# EAGLE design segundero (EAGLE 7.2.0)
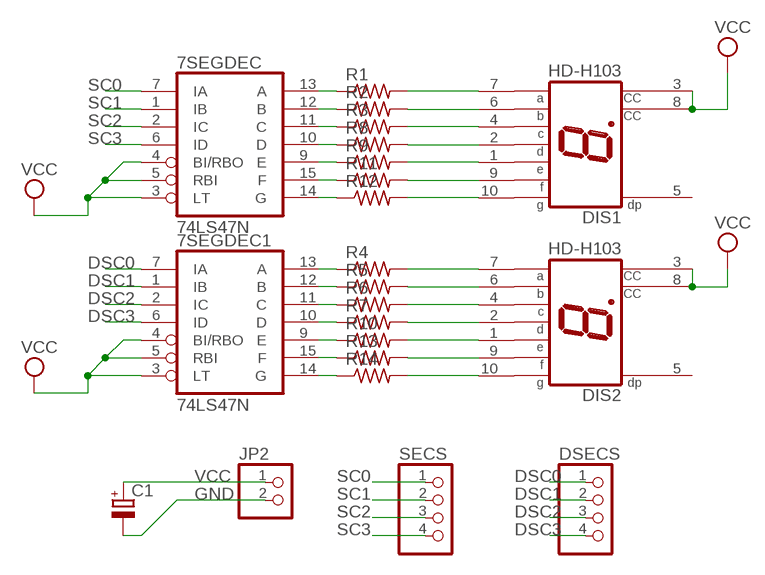
[diagram p0: schematic, sheet 1]

## Parts
7SEGDEC  74LS47N  [DIL16]
7SEGDEC1  74LS47N  [DIL16]
C1  CPOL-EUE2-5  [E2-5]
DIS1  HD-H103  [HDSP-M]
DIS2  HD-H103  [HDSP-M]
DSECS  PINHD-1X4  [1X04]
JP2  PINHD-1X2  [1X02]
R1  R-US_0204/7  [0204/7]
R2  R-US_0204/7  [0204/7]
R3  R-US_0204/7  [0204/7]
R4  R-US_0204/7  [0204/7]
R5  R-US_0204/7  [0204/7]
R6  R-US_0204/7  [0204/7]
R7  R-US_0204/7  [0204/7]
R8  R-US_0204/7  [0204/7]
R9  R-US_0204/7  [0204/7]
R10  R-US_0204/7  [0204/7]
R11  R-US_0204/7  [0204/7]
R12  R-US_0204/7  [0204/7]
R13  R-US_0204/7  [0204/7]
R14  R-US_0204/7  [0204/7]
SECS  PINHD-1X4  [1X04]

## Nets
DSC0: 7SEGDEC1.7(IA) DSECS.1
DSC1: 7SEGDEC1.1(IB) DSECS.2
DSC2: 7SEGDEC1.2(IC) DSECS.3
DSC3: 7SEGDEC1.6(ID) DSECS.4
GND: C1.- JP2.2
N$1: 7SEGDEC1.15(F) R13.1
N$2: 7SEGDEC1.13(A) R4.1
N$3: 7SEGDEC.15(F) R11.1
N$4: 7SEGDEC1.12(B) R5.1
N$5: 7SEGDEC.13(A) R1.1
N$6: 7SEGDEC1.11(C) R6.1
N$7: 7SEGDEC1.10(D) R7.1
N$8: 7SEGDEC1.9(E) R10.1
N$9: 7SEGDEC.12(B) R2.1
N$10: 7SEGDEC.11(C) R3.1
N$11: 7SEGDEC.10(D) R8.1
N$12: 7SEGDEC.9(E) R9.1
N$13: 7SEGDEC.14(G) R12.1
N$14: 7SEGDEC1.14(G) R14.1
N$15: DIS1.7(A) R1.2
N$16: DIS1.6(B) R2.2
N$17: DIS1.4(C) R3.2
N$18: DIS1.2(D) R8.2
N$19: DIS1.1(E) R9.2
N$20: DIS1.9(F) R11.2
N$21: DIS1.10(G) R12.2
N$22: DIS2.7(A) R4.2
N$23: DIS2.6(B) R5.2
N$24: DIS2.4(C) R6.2
N$25: DIS2.2(D) R7.2
N$26: DIS2.1(E) R10.2
N$27: DIS2.9(F) R13.2
N$28: DIS2.10(G) R14.2
SC0: 7SEGDEC.7(IA) SECS.1
SC1: 7SEGDEC.1(IB) SECS.2
SC2: 7SEGDEC.2(IC) SECS.3
SC3: 7SEGDEC.6(ID) SECS.4
VCC: 7SEGDEC1.3(LT) 7SEGDEC1.4(BI/RBO) 7SEGDEC1.5(RBI) 7SEGDEC.3(LT) 7SEGDEC.4(BI/RBO) 7SEGDEC.5(RBI) C1.+ DIS1.3(CC) DIS1.8(CC) DIS2.3(CC) DIS2.8(CC) JP2.1
Unconnected: DIS1.5(DP) DIS2.5(DP)

## Power pins joined to a net without a drawn wire
GND: 7SEGDEC1.8(GND) 7SEGDEC.8(GND)
VCC: 7SEGDEC1.16(VCC) 7SEGDEC.16(VCC)

## Library data of the parts
7SEGDEC 7SEGDEC1 = 74xx-eu:74*47: BCD to seven segment DECODER/DRIVER Source: http://www.ee.washington.edu/stores/DataSheets/74ls/74ls47.pdf
C1 = rcl:CPOL-EU: POLARIZED CAPACITOR, European symbol
DIS1 DIS2 = display-hp:HD-H103: LED DISPLAY 1-character 7 segment, decimal point right; OC_FARNELL: unknown; OC_NEWARK: unknown
DSECS SECS = -redpic-connector(1):PINHD-1X4: Pin Header 4
JP2 = pinhead:PINHD-1X2: PIN HEADER
R1-R14 = resistor:R-US_: RESISTOR, American symbol

## Board
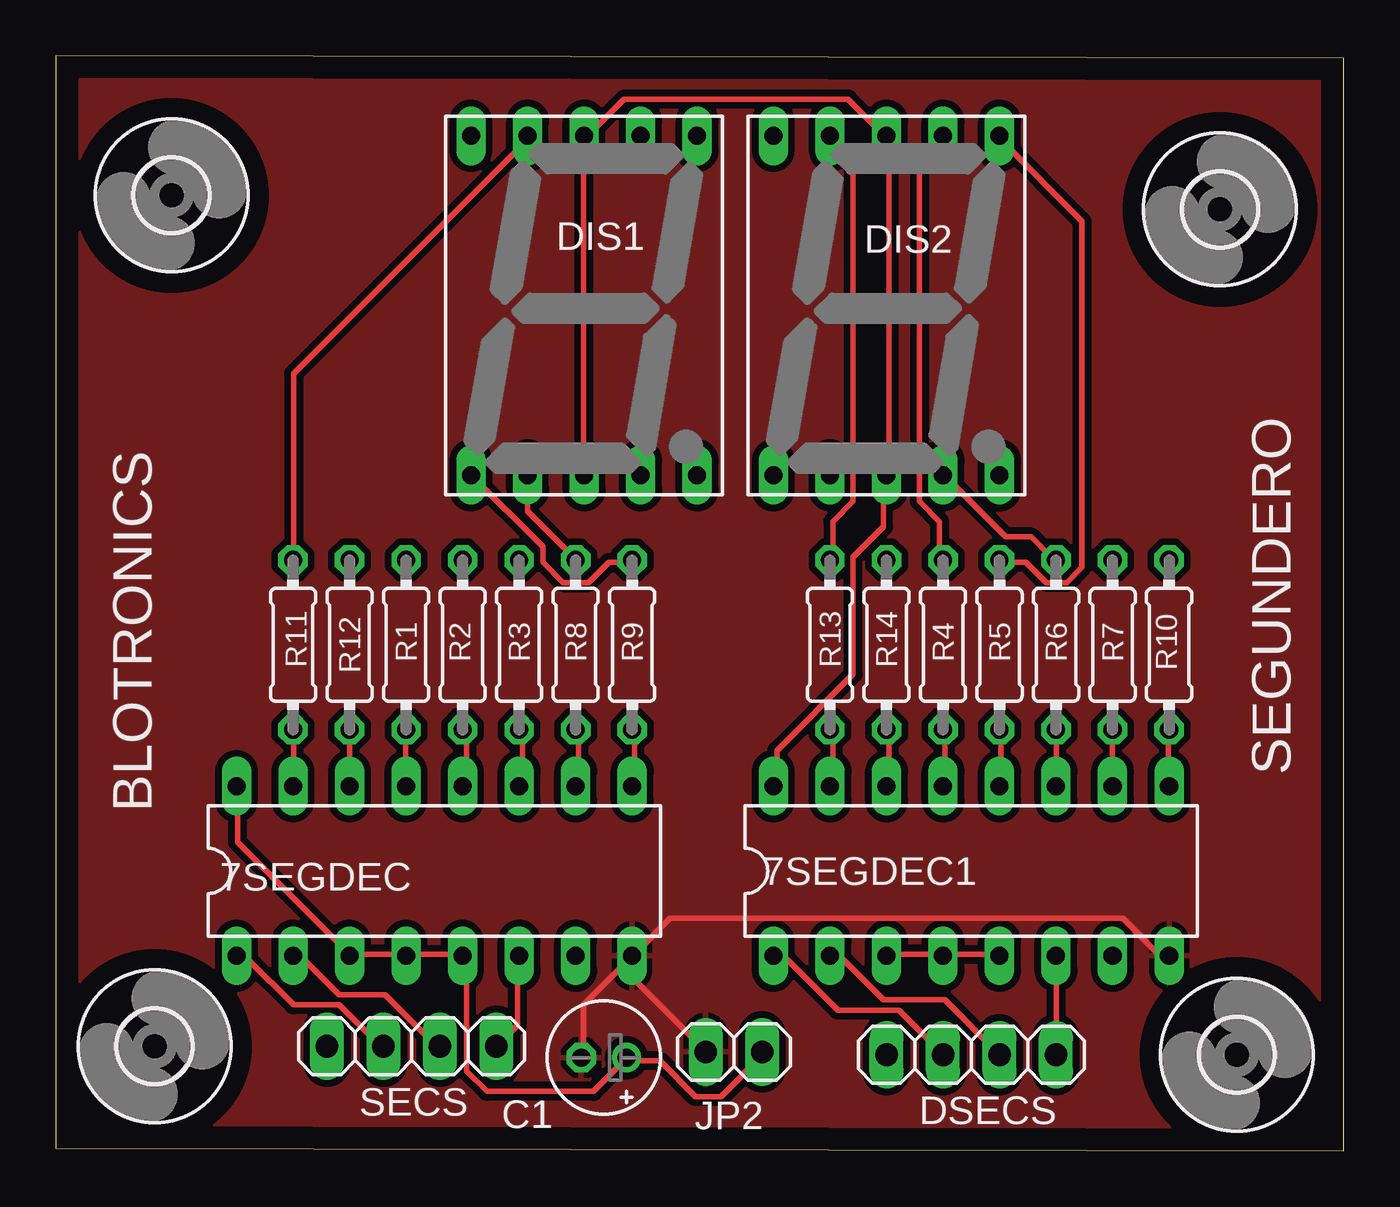
[diagram p1: board, top side]
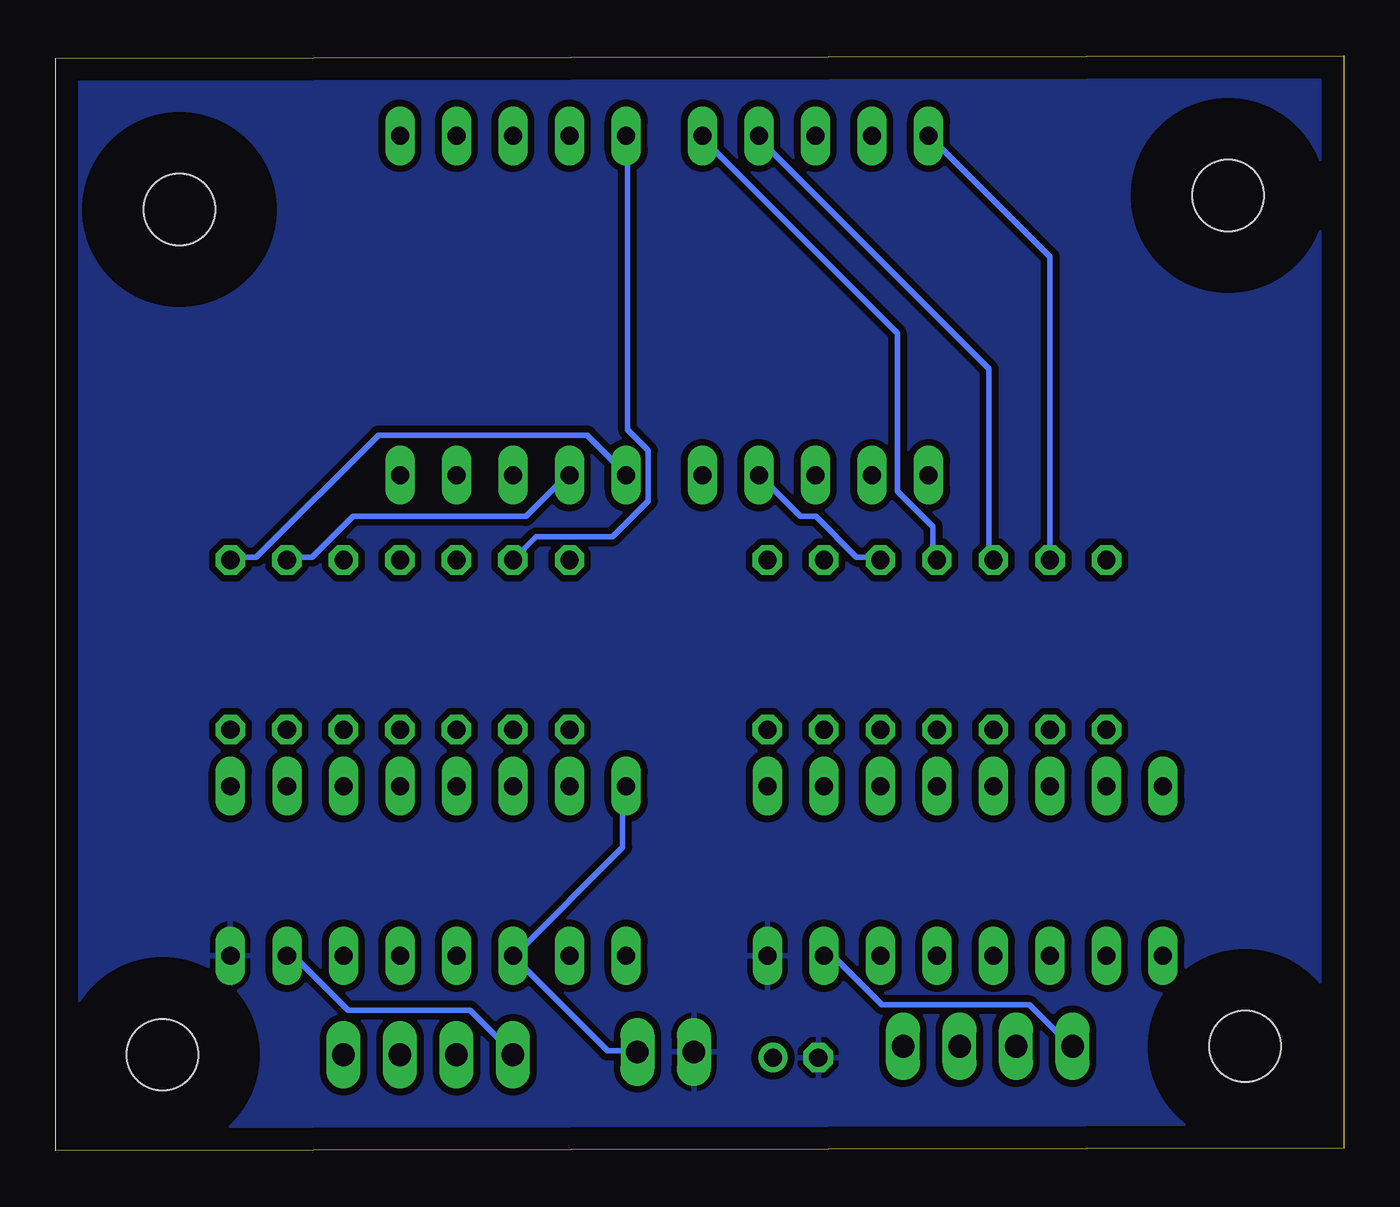
[diagram p2: board, bottom side, seen from below]

Size 57.89 x 49.2 mm. Coordinates in mm from the lower left corner, seen from the top.
Outline: 0,0.13 57.89,0 57.89,49.07 0,49.2 0,0.13
Copper layers (1*16): Top 0.035mm / dielectric 1.5mm / Bottom 0.035mm
Design rules "default": minimum track width 10mil, minimum drill 24mil, track to track 8mil, track to pad 8mil, pad to pad 8mil, via to via 8mil, smd to smd 8mil, copper to edge 40mil, drill to drill 8mil, minimum pad ring 10mil, minimum via ring 8mil, stop-mask expansion 4mil, vias tented up to drill 0mil, thermal gap 10mil

### Footprints (pad centres in the part's own frame; a part is rotated, then mirrored left to right if it is on the bottom)
DIL16 = drill 0.813 long: 1 -8.89,-3.81; 2 -6.35,-3.81; 3 -3.81,-3.81; 4 -1.27,-3.81; 5 1.27,-3.81; 6 3.81,-3.81; 7 6.35,-3.81; 8 8.89,-3.81; 9 8.89,3.81; 10 6.35,3.81; 11 3.81,3.81; 12 1.27,3.81; 13 -1.27,3.81; 14 -3.81,3.81; 15 -6.35,3.81; 16 -8.89,3.81
E2-5 = drill 0.813 pad 1.27: + -1.016,0 | drill 0.813 pad 1.27 octagon: - 1.016,0
HDSP-M = drill 0.813 long: 1 -5.08,-7.62; 2 -2.54,-7.62; 3 0,-7.62; 4 2.54,-7.62; 5 5.08,-7.62; 6 5.08,7.62; 7 2.54,7.62; 8 0,7.62; 9 -2.54,7.62; 10 -5.08,7.62
1X04 = drill 1.016 long: 1 -3.81,0; 2 -1.27,0; 3 1.27,0; 4 3.81,0
1X02 = drill 1.016 long: 1 -1.27,0; 2 1.27,0
0204/7 = drill 0.813 octagon: 1 -3.81,0; 2 3.81,0
3,2 = hole 3.2: 0,0

### Placement (x,y rotation side)
7SEGDEC  17.02,12.57 0 top
7SEGDEC1  41.15,12.57 0 top
C1  24.64,4.19 180 top
DIS1  23.75,37.97 0 top
DIS2  37.34,37.97 0 top
DSECS  41.15,4.32 0 top
JP2  30.48,4.45 180 top
R1  15.75,22.73 90 top
R2  18.29,22.73 90 top
R3  20.83,22.73 90 top
R4  39.88,22.73 90 top
R5  42.42,22.73 90 top
R6  44.96,22.73 90 top
R7  47.5,22.73 90 top
R8  23.37,22.73 90 top
R9  25.91,22.73 90 top
R10  50.04,22.73 90 top
R11  10.67,22.73 90 top
R12  13.21,22.73 90 top
R13  34.8,22.73 90 top
R14  37.34,22.73 90 top
SECS  16,4.7 0 top
U$1  [3,2]  5.21,42.93 0 top
U$2  [3,2]  52.32,42.29 0 top
U$3  [3,2]  4.45,4.7 0 top
U$4  [3,2]  53.09,4.32 0 top

### Tracks (layer width: path | path; a pad name or v marks a point on that pad's centre or on a via)
DSC0
  Bottom 0.254: 7SEGDEC1.7 47.5,8.61 47.04,8.61 44.76,6.32 39.27,6.32 37.44,4.5 DSECS.1
DSC1
  Top 0.254: 7SEGDEC1.1 32.41,8.61 32.87,8.61 35.15,6.32 37.9,6.32 39.73,4.5 DSECS.2
DSC2
  Top 0.254: DSECS.3 39.95,6.78 37.21,6.78 35.38,8.61 34.93,8.61 7SEGDEC1.2
DSC3
  Top 0.254: 7SEGDEC1.6 44.98,8.61 44.98,4.5 DSECS.4
GND
  Top 0.254: 25.32,8.15 25.78,8.61 7SEGDEC.8 | 25.32,8.15 23.72,6.55 23.72,4.27 C1.- | 7SEGDEC1.8 50.01,8.84 49.55,8.84 47.96,10.44 27.61,10.44 26.01,8.84 7SEGDEC.8 | 25.32,8.15 25.55,8.15 29.21,4.5 JP2.2 | 25.32,8.15 7SEGDEC.8
  pour Bottom (isolate 0.305): -1.02,50.29 -1.02,-1.02 63.37,-1.02 63.37,50.29
  pour Top (isolate 0.305): -2.41,50.17 -2.41,-2.79 64.52,-2.79 64.52,50.17
N$1
  Top 0.254: 7SEGDEC1.15 34.93,16.38 34.93,18.9 R13.1
N$2
  Top 0.254: 7SEGDEC1.13 39.95,16.38 39.95,18.9 R4.1
N$3
  Top 0.254: 7SEGDEC.15 10.69,16.38 10.69,18.9 R11.1
N$4
  Top 0.254: 7SEGDEC1.12 42.47,16.38 42.47,18.9 R5.1
N$5
  Top 0.254: 7SEGDEC.13 15.72,16.38 15.72,18.9 R1.1
N$6
  Top 0.254: 7SEGDEC1.11 44.98,16.38 44.98,18.9 R6.1
N$7
  Top 0.254: R7.1 7SEGDEC1.10
N$8
  Top 0.254: 7SEGDEC1.9 50.01,16.38 50.01,18.9 R10.1
N$9
  Top 0.254: 7SEGDEC.12 18.47,16.38 18.47,18.9 R2.1
N$10
  Top 0.254: 7SEGDEC.11 20.98,16.38 20.98,18.9 R3.1
N$11
  Top 0.254: 7SEGDEC.10 23.49,16.38 23.49,18.9 R8.1
N$12
  Top 0.254: 7SEGDEC.9 26.01,16.38 26.01,18.9 R9.1
N$13
  Top 0.254: R12.1 7SEGDEC.14
N$14
  Top 0.254: 7SEGDEC1.14 37.44,16.38 37.44,18.9 R14.1
N$15
  Bottom 0.254: R1.2 15.95,26.67 15.95,35.13 26.24,45.42 DIS1.7
N$16
  Bottom 0.254: R2.2 18.47,26.67 18.47,28.04 20.07,29.64 20.07,36.73 28.75,45.42 DIS1.6
N$17
  Bottom 0.254: R3.2 20.98,26.67 21.9,26.67 23.72,28.5 24.41,28.5 26.24,30.33 DIS1.4
N$18
  Top 0.254: DIS1.2 21.21,28.73 23.27,26.67 R8.2
N$19
  Top 0.254: DIS1.1 21.9,27.13 21.9,26.44 22.81,25.53 23.95,25.53 24.87,26.44 25.78,26.44 R9.2
N$20
  Top 0.254: R11.2 10.69,26.67 10.69,34.9 21.21,45.42 DIS1.9
N$21
  Bottom 0.254: R12.2 13.21,40.16 18.47,45.42 DIS1.10
N$22
  Top 0.254: R4.2 39.73,26.67 39.73,28.27 38.81,29.18 38.81,44.5 39.73,45.42 DIS2.7
N$23
  Top 0.254: R5.2 42.47,26.44 43.61,26.44 44.53,25.53 45.44,25.53 46.13,26.21 46.13,41.76 42.47,45.42 DIS2.6
N$24
  Top 0.254: DIS2.4 39.95,30.33 42.7,27.58 43.84,27.58 44.76,26.67 R6.2
N$25
  Bottom 0.254: R7.2 47.5,26.67 46.35,26.67 44.53,28.5 36.75,28.5 34.93,30.33 DIS2.2
N$26
  Bottom 0.254: R10.2 50.01,26.67 48.87,26.67 43.38,32.16 34.01,32.16 32.41,30.56 DIS2.1
N$27
  Top 0.254: R13.2 34.93,26.67 34.93,28.27 35.84,29.18 35.84,44.5 34.93,45.42 DIS2.9
N$28
  Bottom 0.254: R14.2 36.3,27.58 32.87,27.58 31.27,29.18 31.27,31.47 32.18,32.39 32.18,45.42 DIS2.10
SC0
  Bottom 0.254: 7SEGDEC.7 23.27,8.61 22.81,8.61 20.75,6.55 14.12,6.55 12.29,4.72 SECS.1
SC1
  Top 0.254: 7SEGDEC.1 8.18,8.61 8.64,8.61 10.69,6.55 12.75,6.55 14.58,4.72 SECS.2
SC2
  Top 0.254: 7SEGDEC.2 10.69,8.61 11.15,8.61 12.75,7.01 14.81,7.01 17.09,4.72 SECS.3
SC3
  Top 0.254: SECS.4 20.75,5.64 20.75,8.61 7SEGDEC.6
VCC
  Top 0.254: DIS1.3 23.72,30.56 23.72,45.42 DIS1.8 23.95,45.64 25.55,47.24 35.61,47.24 37.21,45.64 DIS2.8 37.44,45.42 37.44,30.56 DIS2.3 37.21,30.33 37.21,28.04 35.84,26.67 35.84,21.41 32.41,17.98 32.41,16.38 7SEGDEC1.16 | 13.21,8.84 15.72,8.84 7SEGDEC.4 15.95,8.84 18.24,8.84 7SEGDEC.5 18.47,8.61 18.47,3.58 19.38,2.67 24.18,2.67 25.55,4.04 C1.+ 25.78,4.04 27.15,4.04 28.75,2.44 29.9,2.44 31.73,4.27 JP2.1 | 13.21,8.84 8.18,13.87 8.18,16.38 7SEGDEC.16 | 13.21,8.84 7SEGDEC.3 | 7SEGDEC1.3 37.44,8.84 39.73,8.84 7SEGDEC1.4 39.95,8.84 42.24,8.84 7SEGDEC1.5
  Bottom 0.254: 7SEGDEC1.16 32.41,16.38 32.41,13.64 37.21,8.84 7SEGDEC1.3 37.21,8.61 33.1,4.5 31.95,4.5 JP2.1

### Text on the board
tPlace: SEGUNDERO | BLOTRONICS